# EAGLE schematic 411_Preliminary Design_Group8_rev2 (EAGLE 9.6.2)
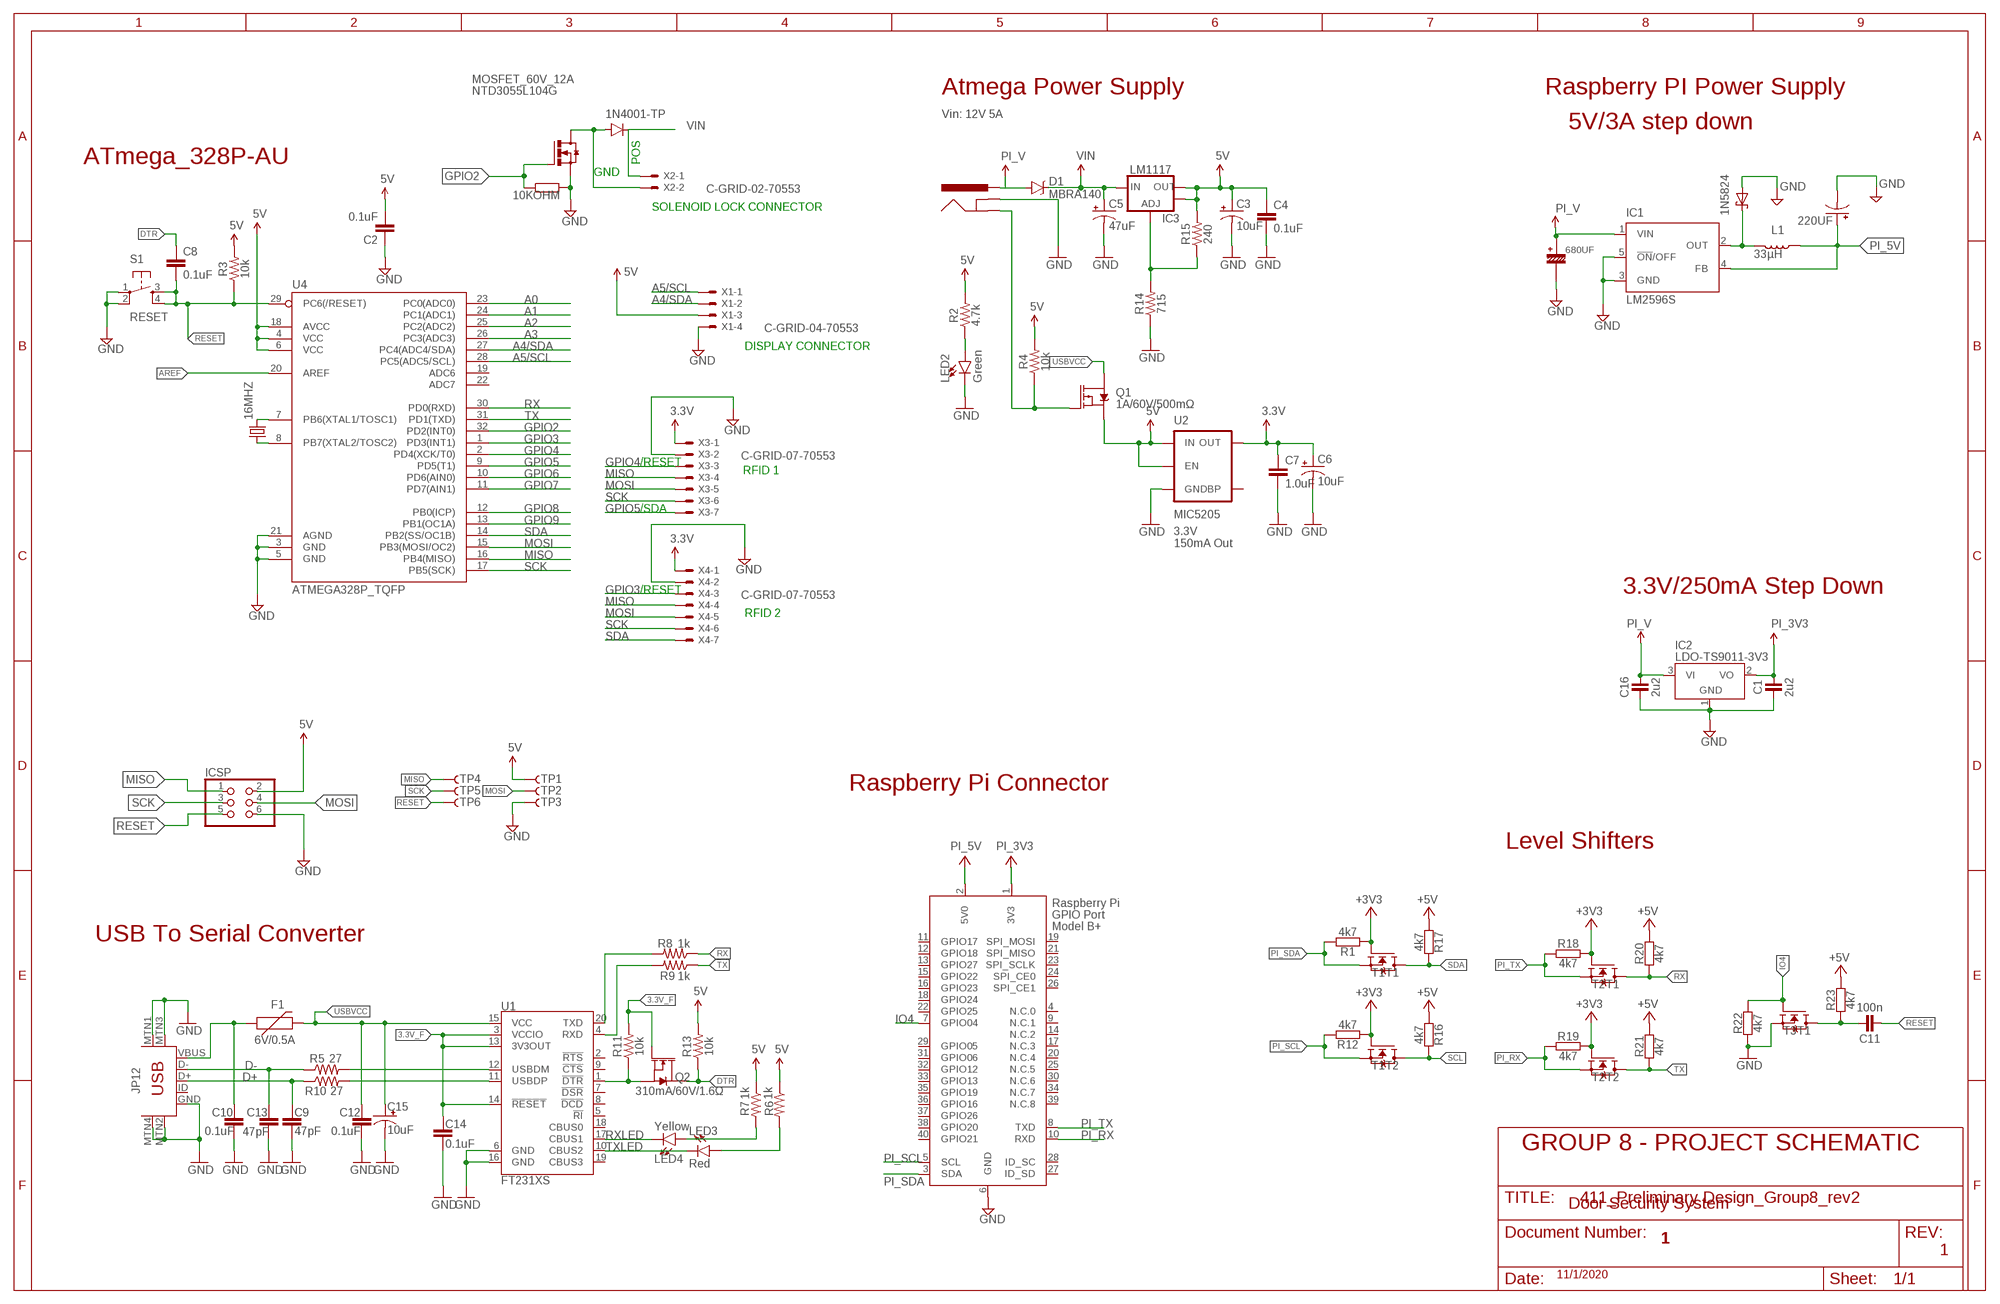
[diagram p0: schematic, sheet 1]

## Parts
1N5824  SCHOTTKY-DIODECB429-15  [CB429-15]
10KOHM  R  (no package)
16MHZ  CRYSTALHC49S  [HC49/S]
220UF  CPOL-US139CLL-2R  [139CLL-2R]
680UF  CE-16V-10-5.08  [16V-10-5.08]
C1  2u2  CAPACITOR-0402  [C0402]
C2  0.1uF  0.1UF-0603-25V-(+80/-20%)  [0603]
C3  10uF  10UF-POLAR-EIA3216-16V-10%(TANT)  [EIA3216]
C4  0.1uF  0.1UF-0603-25V-(+80/-20%)  [0603]
C5  47uF  47UF-POLAR-PANASONIC_D-35V-20%  [PANASONIC_D]
C6  10uF  10UF-POLAR-EIA3216-16V-10%(TANT)  [EIA3216]
C7  1.0uF  1.0UF-0603-16V-10%  [0603]
C8  0.1uF  0.1UF-0603-25V-(+80/-20%)  [0603]
C9  47pF  47PF-0603-50V-5%  [0603]
C10  0.1uF  0.1UF-0603-25V-(+80/-20%)  [0603]
C11  100n  CAPACITOR-0402  [C0402]
C12  0.1uF  0.1UF-0603-25V-(+80/-20%)  [0603]
C13  47pF  47PF-0603-50V-5%  [0603]
C14  0.1uF  0.1UF-0603-25V-(+80/-20%)  [0603]
C15  10uF  10UF-POLAR-EIA3216-16V-10%(TANT)  [EIA3216]
C16  2u2  CAPACITOR-0402  [C0402]
D1  MBRA140  [SMA-DIODE]
F1  6V/0.5A  PTC-HALF_AMP  [1206]
IC1  LM2596S  [TO263-5]
IC2  LDO-TS9011-3V3  [SOT23]
IC3  LM1117  V_REG_LM1117ALT1  [SOT223-ALT1]
ICSP  PINHD-2X3  [2X03]
J3  POWER_JACKSUPER_BOMB_DIGITY  [POWER_JACK_SMD_OVERPASTE_SUPER_BOMB_DIGITY]
JP12  USB-MINIB-5PIN  [USB-MINIB]
L1  33µH  INDUCTOR-0805-3.3UH  [0805]
LED2  Green  LED1206  [LED-1206]
LED3  Red  LED1206  [LED-1206]
LED4  Yellow  LED1206  [LED-1206]
MOSFET_60V_12A  NTD3055L104G  [DPAK3]
Q1  1A/60V/500mΩ  MOSFET-PCH-ZXMP6A13F  [SOT23-3@1]
Q2  310mA/60V/1.6Ω  MOSFET-NCH-2N7002PW  [SOT323]
R1  4k7  RESISTOR-0402  [C0402]
R2  4.7k  4.7KOHM-0603-1/10W-1%  [0603]
R3  10k  10KOHM-0603-1/10W-1%  [0603]
R4  10k  10KOHM-0603-1/10W-1%  [0603]
R5  27  27OHM-0603-1/10W-1%  [0603]
R6  1k  1KOHM-0603-1/10W-1%  [0603]
R7  1k  1KOHM-0603-1/10W-1%  [0603]
R8  1k  1KOHM-0603-1/10W-1%  [0603]
R9  1k  1KOHM-0603-1/10W-1%  [0603]
R10  27  27OHM-0603-1/10W-1%  [0603]
R11  10k  10KOHM-0603-1/10W-1%  [0603]
R12  4k7  RESISTOR-0402  [C0402]
R13  10k  10KOHM-0603-1/10W-1%  [0603]
R14  715  715OHM-0603-1/10W-1%  [0603]
R15  240  240OHM-0603-1/10W-1%  [0603]
R16  4k7  RESISTOR-0402  [C0402]
R17  4k7  RESISTOR-0402  [C0402]
R18  4k7  RESISTOR-0402  [C0402]
R19  4k7  RESISTOR-0402  [C0402]
R20  4k7  RESISTOR-0402  [C0402]
R21  4k7  RESISTOR-0402  [C0402]
R22  4k7  RESISTOR-0402  [C0402]
R23  4k7  RESISTOR-0402  [C0402]
S1  RESET  SWITCH_SPST_4_PINSQUARE  [TACTILE-SWITCH-SMD]
T1  BSS138PS  [SOT363]
T2  BSS138PS  [SOT363]
T3  BSS138PS  [SOT363]
TP1  TP-3x5  TEST-POINT3X5  [PAD.03X.05]
TP2  TP-3x5  TEST-POINT3X5  [PAD.03X.05]
TP3  TP-3x5  TEST-POINT3X5  [PAD.03X.05]
TP4  TP-3x5  TEST-POINT3X5  [PAD.03X.05]
TP5  TP-3x5  TEST-POINT3X5  [PAD.03X.05]
TP6  TP-3x5  TEST-POINT3X5  [PAD.03X.05]
U1  FT231XS  [SSOP20_L]
U2  MIC5205  MIC52053.3V  [SOT23-5]
U4  ATMEGA328P_TQFP  [TQFP32-08]
X1  C-GRID-04-70553  [70553-04]
X2  C-GRID-02-70553  [70553-02]
X3  C-GRID-07-70553  [70553-07]
X4  C-GRID-07-70553  [70553-07]
X5  RASPI_BOARD_B+_E4P  [RASPI_BOARD_B+_EDGES_4DRILL_PAD]

## Nets
3.3V: C6.+ C7.1 U2.5(OUT) X3.1 X4.1
3.3V_F: C14.1 Q2.1(G) R11.2 U1.3(VCCIO) U1.13(3V3OUT) U1.14(!RESET)
5V: C2.2 C3.+ C4.1 IC3.2(OUT) IC3.4(OUT) ICSP.2 Q1.2(S) R2.2 R3.2 R4.2 R6.1 R7.1 R13.2 R15.2 TP1.P$1 U2.1(IN) U2.3(EN) U4.4(VCC) U4.6(VCC) U4.18(AVCC) X1.3
+3V3: R1.1 R12.1 R18.2 R19.2 T1.2(T1:G) T1.5(T2:G) T2.2(T1:G) T2.5(T2:G)
+5V: R16.1 R17.1 R20.2 R21.2 R23.2
A0: U4.23(PC0(ADC0))
A1: U4.24(PC1(ADC1))
A2: U4.25(PC2(ADC2))
A3: U4.26(PC3(ADC3))
A4/SDA: U4.27(PC4(ADC4/SDA)) X1.2
A5/SCL: U4.28(PC5(ADC5/SCL)) X1.1
AREF: U4.20(AREF)
D0_RX1: C11.2 R23.1 T3.6(T1:D)
D+: C9.1 JP12.D+ R10.1
D-: C13.1 JP12.D- R5.1
DTR: C8.1 Q2.3(D) R13.1
FTDI_DTR: Q2.2(S) R11.1 U1.1(!DTR)
GND: 1N5824.A 10KOHM.2 220UF.- 680UF.- C1.1 C2.1 C3.- C4.2 C5.- C6.- C7.2 C9.2 C10.2 C12.2 C13.2 C14.2 C15.- C16.1 IC1.3(GND) IC1.5(!ON!/OFF) IC2.1(GND) ICSP.6 J3.GND(GNDBREAK) JP12.GND JP12.MTN1(MTN2) JP12.MTN2(MTN3) JP12.MTN3(MTN1) JP12.MTN4 LED2.C MOSFET_60V_12A.2(S) R14.1 R22.1 S1.1 S1.2 T3.1(T1:S) TP3.P$1 U1.6(GND) U1.16(GND) U2.2(GND) U4.3(GND) U4.5(GND) U4.21(AGND) X1.4 X3.2 X4.2 X5.6(GND)
GPIO2: 10KOHM.1 MOSFET_60V_12A.1(G) U4.32(PD2(INT0))
GPIO3: U4.1(PD3(INT1)) X4.3
GPIO4: U4.2(PD4(XCK/T0)) X3.3
GPIO5: U4.9(PD5(T1)) X3.7
GPIO6: U4.10(PD6(AIN0))
GPIO7: U4.11(PD7(AIN1))
GPIO8: U4.12(PB0(ICP))
GPIO9: U4.13(PB1(OC1A))
INSERT: J3.P$4(GND) Q1.1(G) R4.1
IO4: R22.2 T3.2(T1:G) X5.7(GPIO04)
MISO: ICSP.1 TP4.P$1 U4.16(PB4(MISO)) X3.4 X4.4
MOSI: ICSP.4 TP2.P$1 U4.15(PB3(MOSI/OC2)) X3.5 X4.5
N$1: 1N5824.C IC1.2(OUT) L1.2
N$2: LED2.A R2.1
N$3: 16MHZ.2 U4.7(PB6(XTAL1/TOSC1))
N$4: 16MHZ.1 U4.8(PB7(XTAL2/TOSC2))
N$5: MOSFET_60V_12A.3(D) X2.2
N$6: R5.2 U1.12(USBDM)
N$7: R10.2 U1.11(USBDP)
N$8: LED3.A R6.2
N$9: IC1.4(FB)
N$10: LED4.A R7.2
N$15: IC3.1(ADJ) R14.2 R15.1
PI_3V3: C1.2 IC2.2(VO) X5.1(3V3) ; supply symbol labelled 3.3V, +3V3
PI_5V: 220UF.+ L1.1 X5.2(5V0) ; supply symbol labelled +5V
PI_RX: R19.1 T2.4(T2:S) X5.10(RXD)
PI_SCL: R12.2 T1.4(T2:S) X5.5(SCL)
PI_SDA: R1.2 T1.1(T1:S) X5.3(SDA)
PI_TX: R18.1 T2.1(T1:S) X5.8(TXD)
PI_V: 680UF.+ C16.2 IC1.1(VIN) IC2.3(VI)
PWRIN: D1.A J3.VIN0(PWR)
RESET: C8.2 C11.1 ICSP.5 R3.1 S1.3 S1.4 TP6.P$1 U4.29(PC6(/RESET))
RX: R8.1 R20.1 T2.6(T1:D) U4.30(PD0(RXD))
RXD: R9.2 U1.4(RXD)
RXLED: LED4.C U1.17(CBUS1)
SCK: ICSP.3 TP5.P$1 U4.17(PB5(SCK)) X3.6 X4.6
SCL: R16.2 T1.3(T2:D)
SDA: R17.2 T1.6(T1:D) U4.14(PB2(SS/OC1B)) X4.7
TX: R9.1 R21.1 T2.3(T2:D) U4.31(PD1(TXD))
TXD: R8.2 U1.20(TXD)
TXLED: LED3.C U1.10(CBUS2)
USBVCC: C12.1 C15.+ F1.2 Q1.3(D) U1.15(VCC)
VIN: C5.+ D1.C IC3.3(IN) X2.1 ; supply symbol labelled PI_V
VUSB: C10.1 F1.1 JP12.VBUS
Unconnected: JP12.ID T3.3(T2:D) T3.4(T2:S) T3.5(T2:G) U1.2(!RTS) U1.5(!RI) U1.7(!DSR) U1.8(!DCD) U1.9(!CTS) U1.18(CBUS0) U1.19(CBUS3) U2.4(BP) U4.19(ADC6) U4.22(ADC7) X5.4(N.C.0) X5.9(N.C.1) X5.11(GPIO17) X5.12(GPIO18) X5.13(GPIO27) X5.14(N.C.2) X5.15(GPIO22) X5.16(GPIO23) X5.17(N.C.3) X5.18(GPIO24) X5.19(SPI_MOSI) X5.20(N.C.4) X5.21(SPI_MISO) X5.22(GPIO25) X5.23(SPI_SCLK) X5.24(SPI_CE0) X5.25(N.C.5) X5.26(SPI_CE1) X5.27(ID_SD) X5.28(ID_SC) X5.29(GPIO05) X5.30(N.C.6) X5.31(GPIO06) X5.32(GPIO12) X5.33(GPIO13) X5.34(N.C.7) X5.35(GPIO19) X5.36(GPIO16) X5.37(GPIO26) X5.38(GPIO20) X5.39(N.C.8) X5.40(GPIO21)

## Notes on the sheet
- Atmega Power Supply | Raspberry PI Power Supply
- 1N4001-TP | Vin: 12V 5A
- 5V/3A step down
- ATmega_328P-AU | POS
- GND
- SOLENOID LOCK CONNECTOR
- DISPLAY CONNECTOR
- /RESET | RFID 1
- /SDA
- 3.3V
  150mA Out
- /RESET | 3.3V/250mA Step Down
- RFID 2
- SDA
- Level Shifter
- Raspberry Pi Connector
- Level Shifters
- USB To Serial Converter
- GROUP 8 - PROJECT SCHEMATIC
- Door Security System
- 1
- 1
- 11/1/2020

## Library data of the parts
1N5824 = adafruit:SCHOTTKY-DIODE: Schottky Diode
10KOHM = ngspice-simulation:R: RESISTOR
16MHZ = crystal:CRYSTAL: CRYSTAL; OC_FARNELL: 1667008; OC_NEWARK: unknown
220UF = adafruit:CPOL-US: POLARIZED CAPACITOR, American symbol
680UF = c-j:CE-: ELECTROLYTIC CAPACITOR Japanese symbol
C1 C11 C16 = we-rcl:CAPACITOR: Capacitors ...4.7uF @ 6.3V -> 0402 ...10uF @ 16V -> 0603 ...22uF @ 25V -> 0805
C2 C4 C8 C10 C12 C14 = SparkFun-Capacitors:0.1UF: 0.1µF ceramic capacitors A capacitor is a passive two-terminal electrical component used to store electrical energy temporarily in an electric field.; PROD_ID: CAP-00810
C3 C6 C15 = SparkFun-Capacitors:10UF-POLAR: 10.0µF polarized capacitors A capacitor is a passive two-terminal electrical component used to store electrical energy temporarily in an electric field.; PROD_ID: CAP-00811
C5 = SparkFun-Capacitors:47UF-POLAR: 47µF polarized capacitors A capacitor is a passive two-terminal electrical component used to store electrical energy temporarily in an electric field.; PROD_ID: CAP-08478
C7 = SparkFun-Capacitors:1.0UF: 1µF ceramic capacitors A capacitor is a passive two-terminal electrical component used to store electrical energy temporarily in an electric field.; PROD_ID: CAP-00868
C9 C13 = SparkFun-Capacitors:47PF: 47pF ceramic capacitors A capacitor is a passive two-terminal electrical component used to store electrical energy temporarily in an electric field.; PROD_ID: CAP-08913
D1 = SparkFun-DiscreteSemi:MBRA140: 40V, 1A Schottky rectifier SMA/DO-214AC package DIO-08053; PROD_ID: DIO-08053
F1 = SparkFun-Fuses:PTC: Resettable Fuse PTC Resettable Fuse. Really a resistor with a postive temperature coefficient who's resistance increases dramatically with an increase in temperature. When heated by the power passing through the resistance rises causing the current to be limited, protecting the circuit. When a PTC cools back down it resumes conducting letting the circuit turn back on.; PROD_ID: RES-08585
IC1 = national-semiconductor:LM2596: SIMPLE SWITCHER® Power Converter 150 kHz 3A Step-Down Voltage Regulator Source: http://www.national.com/ds/LM/LM2596.pdf; MF: NATIONAL SEMICONDUCTOR; MPN: LM2596S-ADJ/NOPB; OC_FARNELL: 9494367; OC_NEWARK: 41K3842
IC2 = we-power:LDO: LDOs TS1117 800mA, Vin max 12V - compatible NCP1117 1A, Vin max 20V TS9011 250mA, Vin max 12V - compatible AP2210 300mA, Vin max 15V TS5204 150mA, Vin max 16V
IC3 = Testing:V_REG_LM1117: Voltage Regulator LM1117 Standard adjustable voltage regulator but in SMD form. Spark Fun Electronics SKU : COM-00595; PROD_ID: VREG-08170
ICSP = pinhead:PINHD-2X3: PIN HEADER
J3 = Testing:POWER_JACK: Power Jack This is the standard 5.5mm barrel jack for power. The PTH is the most common, proven, reliable, footprint. All others are experimental. The Slot footprint only works if the mill layer is transmitted to the PCB fab house so be warned. Spark Fun Electronics SKU : PRT-00119. Mating wall wart : TOL-00298 (and others); PROD_ID: CONN-08106
JP12 = SparkFun-Connectors:USB-MINIB: Mini-USB "B" connector with 5th pin broken out. Created new symbol breaking out 5th "ID" pin in mini/micro USB connector spec. See: http://en.wikipedia.org/wiki/Mini_usb#Cables. Uses same footprint as 4-pin symbol. Also added pins to connect to mounting / shield pads if required (probably not generally needed as signals aren't shielded once they leave the connector).; PROD_ID: CONN-08193
L1 = SparkFun-Coils:INDUCTOR: Inductors Resist changes in electrical current. Basically a coil of wire. SparkFun Products: SparkFun Load Cell Amplifier - HX711 <https://www.sparkfun.com/products/13879> IOIO-OTG - V2.2 <https://www.sparkfun.com/products/13613>; PROD_ID: NDUC-13076; VALUE: 3.3µH/±20%/450mA
LED2 = SparkFun-LED:LED: LED (Generic) Standard schematic elements and footprints for 5mm, 3mm, 1206, and 0603 sized LEDs. Generic LEDs with no color specified.; PROD_ID: DIO-09910
LED3 = SparkFun-LED:LED: LED (Generic) Standard schematic elements and footprints for 5mm, 3mm, 1206, and 0603 sized LEDs. Generic LEDs with no color specified.; PROD_ID: DIO-09912
LED4 = SparkFun-LED:LED: LED (Generic) Standard schematic elements and footprints for 5mm, 3mm, 1206, and 0603 sized LEDs. Generic LEDs with no color specified.; PROD_ID: DIO-09909
MOSFET_60V_12A = Transistor:NTD3055L104G: 12 A, 60 V, Logic Level N−Channel DPAK/IPAK Manufacturer's datasheet <https://www.onsemi.com/pub/Collateral/NTD3055L104-D.PDF>; CREATED_BY: PCBLayout.com; MANUFACTURER: ON SEMICONDUCTORS; MPN: NTD3055L104G; PACKAGE: DPAK-4
Q1 = SparkFun-DiscreteSemi:MOSFET-PCH: P-channel MOSFETs Voltage controlled devices that allow control of high current outputs.; PROD_ID: TRANS-08285
Q2 = SparkFun-DiscreteSemi:MOSFET-NCH: N-channel MOSFETs Voltage controlled devices that allow control of high current outputs. SparkFun Products: SparkFun OpenScale <https://www.sparkfun.com/products/13261> SparkFun Digital Sandbox <https://www.sparkfun.com/products/12651> SparkFun Monster Moto Shield <https://www.sparkfun.com/products/10182> SparkFun MOSFET Power Controller <https://www.sparkfun.com/products/11214>; PROD_ID: TRANS-11151
R1 R12 R16-R23 = we-rcl:RESISTOR: Resistors all kinds in 0603 and 0402
R2 = SparkFun-Resistors:4.7KOHM: 4.7kΩ resistor A resistor is a passive two-terminal electrical component that implements electrical resistance as a circuit element. Resistors act to reduce current flow, and, at the same time, act to lower voltage levels within circuits. - Wikipedia; PROD_ID: RES-07857
R3 R4 R11 R13 = SparkFun-Resistors:10KOHM: 10kΩ resistor A resistor is a passive two-terminal electrical component that implements electrical resistance as a circuit element. Resistors act to reduce current flow, and, at the same time, act to lower voltage levels within circuits. - Wikipedia; PROD_ID: RES-00824
R5 R10 = SparkFun-Resistors:27OHM: 27Ω resistor A resistor is a passive two-terminal electrical component that implements electrical resistance as a circuit element. Resistors act to reduce current flow, and, at the same time, act to lower voltage levels within circuits. - Wikipedia; PROD_ID: RES-09334
R6-R9 = SparkFun-Resistors:1KOHM: 1kΩ resistor A resistor is a passive two-terminal electrical component that implements electrical resistance as a circuit element. Resistors act to reduce current flow, and, at the same time, act to lower voltage levels within circuits. - Wikipedia; PROD_ID: RES-07856
R14 = SparkFun-Resistors:715OHM: 715Ω resistor A resistor is a passive two-terminal electrical component that implements electrical resistance as a circuit element. Resistors act to reduce current flow, and, at the same time, act to lower voltage levels within circuits. - Wikipedia; PROD_ID: RES-07850
R15 = SparkFun-Resistors:240OHM: 240Ω resistor A resistor is a passive two-terminal electrical component that implements electrical resistance as a circuit element. Resistors act to reduce current flow, and, at the same time, act to lower voltage levels within circuits. - Wikipedia; PROD_ID: RES-07849
S1 = SparkFun-Electromechanical:SWITCH_SPST_4_PIN; PROD_ID: SWCH-08247
T1-T3 = we-transistor:BSS138PS: BSS138 Dual N-Channel MOSFET (UGS +/-20V, RDS 1Ohm, ID 320mA)
TP1-TP4 TP6 = SparkFun-Connectors:TEST-POINT: SparkFun Test Points Bare copper test points for troubleshooting or In-Circuit-Testing. These are used by our Production team for verifying production board runs using pogo-pins on test beds. SparkFun Products: SparkFun LSM9DS1 Breakout <https://www.sparkfun.com/products/13284> SparkFun PSOC <https://www.sparkfun.com/products/13714> SparkFun Load Cell Amplifier <https://www.sparkfun.com/products/13879>
TP5 = SparkFun-Passives:TEST-POINT: Bare copper test points for troubleshooting or ICT
U1 = SparkFun-IC-Comms:FT231X: FTDI FT231X Full Speed USB to Full-handshake UART This USB2.0 Full Speed IC offers a compact bridge to full handshake UART interfaces. The device is a UART, capable of operating up to 3MBaud, with low power consumption (8mA). The FT231X includes the complete FT-X series feature set and enables USB to be added into a system design quickly and easily over a UART interface. Datasheet <http://cdn.sparkfun.com/datasheets/Components/General%20IC/DS_FT231X.pdf> SparkFun Products SparkFun RedBoard - Programmed with Arduino <https://www.sparkfun.com/products/12757> (DEV-12757) SparkFun XBee Explorer USB <https://www.sparkfun.com/products/11812> (WRL-11812) SparkFun XBee Explorer Dongle <https://www.sparkfun.com/products/11697> (WRL-11697) SparkFun Blynk Board - ESP8266 <https://www.sparkfun.com/products/13794> (WRL-13794) SparkFun ESP8266 Thing - Dev Board <https://www.sparkfun.com/products/13711> (WRL-13711) SparkFun Block for Intel® Edison - Base <https://www.sparkfun.com/products/13045> (DEV-13045) SparkFun RedStick <https://www.sparkfun.com/products/13741> (DEV-13741) SparkFun Beefy 3 - FTDI Basic Breakout <https://www.sparkfun.com/products/13746> (DEV-13746) SparkFun FT231X Breakout <https://www.sparkfun.com/products/11736> (BOB-11736); PROD_ID: IC-11524
U2 = SparkFun-PowerIC:MIC5205: MIC5205 150mA vreg 3.3V - VREG-00822 5V - VREG-00823; PROD_ID: VREG-00822
U4 = SparkFun-IC-Microcontroller:ATMEGA328P_TQFP: Popular 328P in QFP Storefront component: ATmega328 - TQFP <https://www.sparkfun.com/products/13448> (COM-13448) Datasheet <http://www.sparkfun.com/datasheets/Components/SMD/ATMega328.pdf> SparkFun Products SparkFun RedBoard - Programmed with Arduino <https://www.sparkfun.com/products/12757> (DEV-12757) Arduino Pro Mini 328 - 5V/16MHz <https://www.sparkfun.com/products/11113> (DEV-11113) Arduino Pro Mini 328 - 3.3V/8MHz <https://www.sparkfun.com/products/11114> (DEV-11114) SparkFun OpenLog <https://www.sparkfun.com/products/13712> (DEV-13712) SparkFun MicroView - OLED Arduino Module <https://www.sparkfun.com/products/12923> (DEV-12923) SparkFun Digital Sandbox <https://www.sparkfun.com/products/12651> (DEV-12651) SparkFun PicoBoard <https://www.sparkfun.com/products/11888> (WIG-11888) Arduino Fio <https://www.sparkfun.com/products/10116> (DEV-10116) LilyPad Arduino 328 Main Board <https://www.sparkfun.com/products/13342> (DEV-13342) SparkFun RedStick <https://www.sparkfun.com/products/13741> (DEV-13741) LilyPad MP3 <https://www.sparkfun.com/products/11013> (DEV-11013) LilyPad Arduino SimpleSnap <https://www.sparkfun.com/products/10941> (DEV-10941) SparkFun Stepoko <https://www.sparkfun.com/products/13899> (ROB-13899) SparkFun Geiger Counter <https://www.sparkfun.com/products/11345> (SEN-11345) SparkFun EL Sequencer <https://www.sparkfun.com/products/12781> (COM-12781) Arduino Pro 328 - 5V/16MHz <https://www.sparkfun.com/products/10915> (DEV-10915) CryptoCape <https://www.sparkfun.com/products/12773> (DEV-12773) SparkFun IR Thermometer Evaluation Board - MLX90614 <https://www.sparkfun.com/products/10740> (SEN-10740) SparkFun RedBot Mainboard <https://www.sparkfun.com/products/12097> (ROB-12097) Arduino Pro 328 - 3.3V/8MHz <https://www.sparkfun.com/products/10914> (DEV-10914) SparkFun Block for Intel® Edison - Arduino <https://www.sparkfun.com/products/13036> (DEV-13036) SparkFun Simon Says - Surface Mount Soldering Kit <https://www.sparkfun.com/products/10935> (KIT-10935) SparkFun 7-Segment Serial Display - Red <https://www.sparkfun.com/products/11441> (COM-11441) SparkFun 7-Segment Serial Display - White <https://www.sparkfun.com/products/11629> (COM-11629) SparkFun 7-Segment Serial Display - Yellow <https://www.sparkfun.com/products/11443> (COM-11443) SparkFun 7-Segment Serial Display - Kelly Green <https://www.sparkfun.com/products/11440> (COM-11440) SparkFun 7-Segment Serial Display - Blue <https://www.sparkfun.com/products/11442> (COM-11442) SparkFun OpenSegment Serial Display - 20mm (Blue) <https://www.sparkfun.com/products/11647> (COM-11647) SparkFun OpenSegment Serial Display - 20mm (Green) <https://www.sparkfun.com/products/11646> (COM-11646) SparkFun OpenSegment Serial Display - 20mm (White) <https://www.sparkfun.com/products/11648> (COM-11648) SparkFun OpenSegment Serial Display - 20mm (Red) <https://www.sparkfun.com/products/11644> (COM-11644) SparkFun OpenSegment Serial Display - 20mm (Yellow) <https://www.sparkfun.com/products/11645> (COM-11645) SparkFun OpenSegment Shield <https://www.sparkfun.com/products/13190> (DEV-13190); PROD_ID: IC-09069
X1 = con-molex:C-GRID-04: CONNECTOR wire to board 2.54 mm (0.100") pitch header; MF: MOLEX; OC_FARNELL: unknown; OC_NEWARK: unknown
X2 = con-molex:C-GRID-02: CONNECTOR wire to board 2.54 mm (0.100") pitch header; MF: MOLEX; OC_FARNELL: unknown; OC_NEWARK: unknown
X3 X4 = con-molex:C-GRID-07: CONNECTOR wire to board 2.54 mm (0.100") pitch header; MF: MOLEX; OC_FARNELL: unknown; OC_NEWARK: unknown
X5 = raspberrypi_bastelstube_v13:RASPI_BOARD_B+: Raspberry Pi GPIO connector with markings for the outer dimensions of the Raspberry Pi board model B+ with different sets of drill holes or mounting pads